# EAGLE design Laundry_Switch (EAGLE 8.7.0)
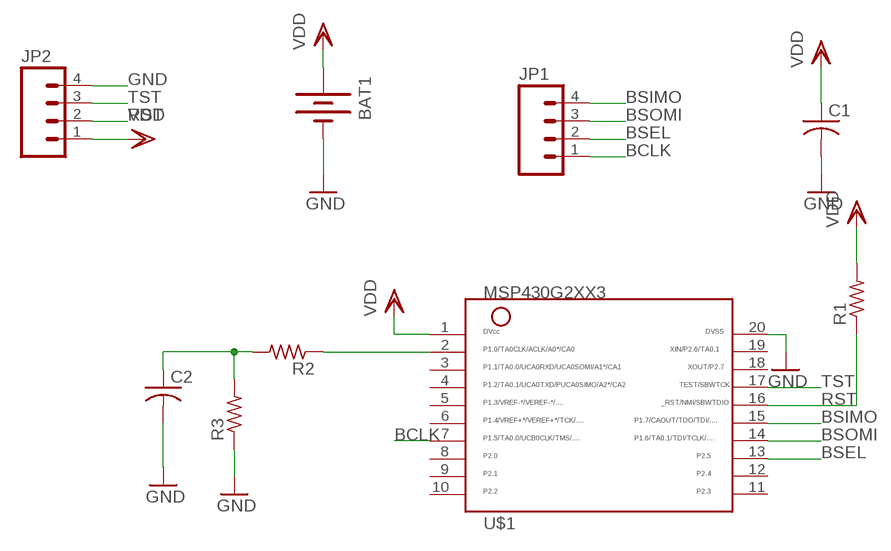
[diagram p0: schematic, sheet 1]

## Parts
BAT1  BATTERYBU2032SM  [BU2032SM]
C1  RCL_C-USC1206  [RCL_C1206]
C2  C-US050-050X075  [C050-050X075]
JP1  PENDANT_M04LOCK  [PENDANT_1X04_LOCK]
JP2  PENDANT_M04LOCK  [PENDANT_1X04_LOCK]
R1  RCL_R-US_R1206  [RCL_R1206]
R2  RCL_R-US_R1206  [RCL_R1206]
R3  RCL_R-US_R1206  [RCL_R1206]
U$1  MSP430G2XX3TSSOP  [PW20]

## Nets
BCLK: JP1.1 U$1.7
BSEL: JP1.2 U$1.13
BSIMO: JP1.4 U$1.15
BSOMI: JP1.3 U$1.14
GND: BAT1.P$2(-) C1.2 C2.2 JP2.4 R3.1 U$1.20
N$1: R2.1 U$1.2
N$3: C2.1 R2.2 R3.2
RST: JP2.2 R1.1 U$1.16
TST: JP2.3 U$1.17
VDD: BAT1.P$1(+) C1.1 JP2.1 R1.2 U$1.1
Unconnected: U$1.3 U$1.4 U$1.5 U$1.6 U$1.8 U$1.9 U$1.10 U$1.11 U$1.12 U$1.18 U$1.19

## Library data of the parts
BAT1 = ELEC327:BATTERY: Battery Holders Various common sizes : AA, AAA, 20mm coin cell and 12mm coin cell. 20MM_4LEGS, BATT-10373
C1 = Pendant:RCL_C-US: CAPACITOR, American symbol
C2 = rcl:C-US: CAPACITOR, American symbol; SPICEPREFIX: C
JP1 JP2 = Bonus:PENDANT_M04: Header 4 Standard 4-pin 0.1" header. Use with straight break away headers (SKU : PRT-00116), right angle break away headers (PRT-00553), swiss pins (PRT-00743), machine pins (PRT-00117), and female headers (PRT-00115). Molex polarized connector foot print use with SKU : PRT-08231 with associated crimp pins and housings.
R1-R3 = Pendant:RCL_R-US_: RESISTOR, American symbol
U$1 = ELEC327:MSP430G2XX3: MSP430G2XX3 PDIP (N) 20 Pin Package

## Board
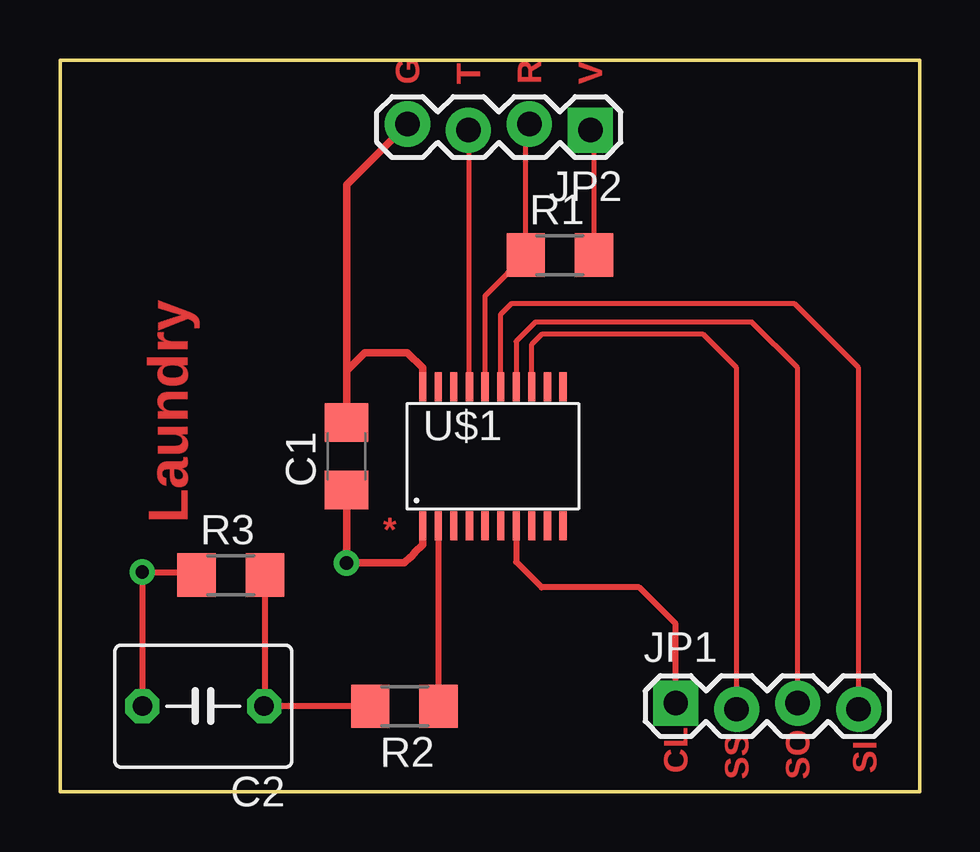
[diagram p1: board, top side]
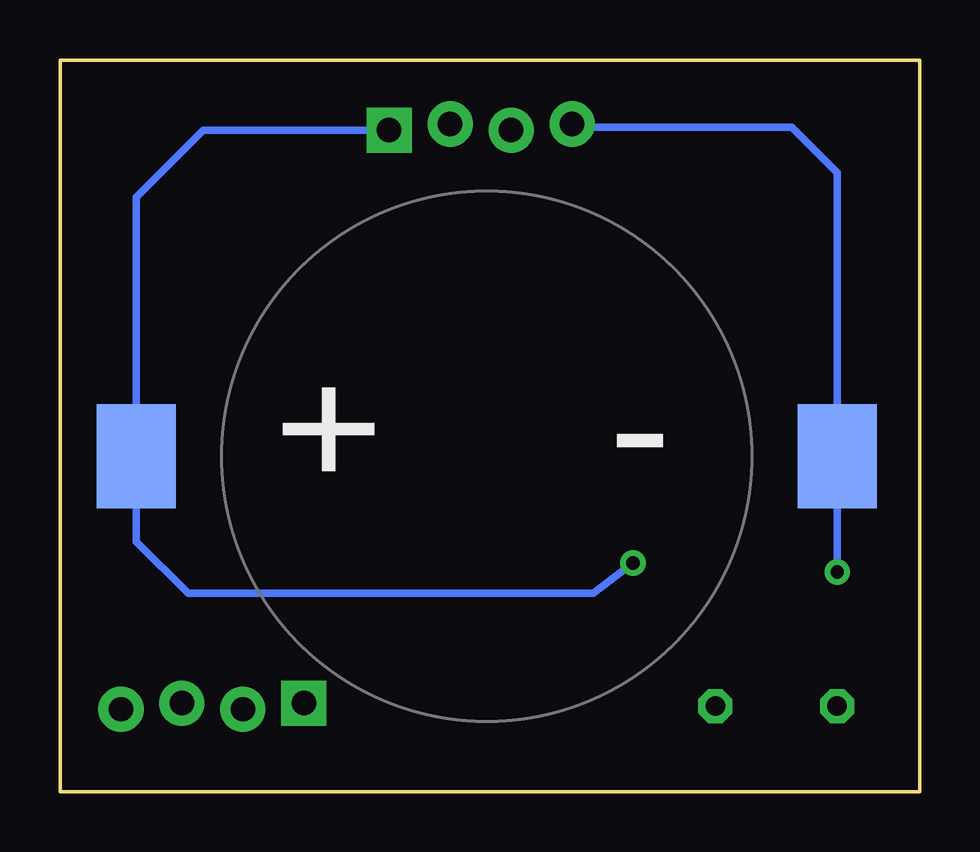
[diagram p2: board, bottom side, seen from below]

Size 35.81 x 30.48 mm. Coordinates in mm from the lower left corner, seen from the top.
Outline: 0,0 0,30.48 35.81,30.48 35.81,0 0,0
Copper layers (1*16): Top 0.035mm / dielectric 1.5mm / Bottom 0.035mm
Design rules "AdvancedCircuitsBarebones": minimum track width 6mil, minimum drill 20mil, track to track 6mil, track to pad 6mil, pad to pad 6mil, via to via 6mil, smd to smd 6mil, copper to edge 10mil, drill to drill 6mil, minimum pad ring 12mil, minimum via ring 10mil, stop-mask expansion 4mil, vias tented up to drill 25mil, thermal gap 10mil

### Footprints (pad centres in the part's own frame; a part is rotated, then mirrored left to right if it is on the bottom)
BU2032SM = smd 3.302 x 4.318: P$1 -14.605,0; P$2 14.605,0
RCL_C1206 = smd 1.6 x 1.8: 1 -1.4,0; 2 1.4,0
C050-050X075 = drill 0.813 octagon: 1 -2.54,0; 2 2.54,0
PENDANT_1X04_LOCK = drill 1.016 pad 1.88 square: 1 0,0.127 | drill 1.016 pad 1.88: 2 2.54,-0.127; 3 5.08,0.127; 4 7.62,-0.127
RCL_R1206 = smd 1.6 x 1.803: 1 -1.422,0; 2 1.422,0
PW20 = smd 0.3 x 1.2: 1 -2.925,-2.9; 2 -2.275,-2.9; 3 -1.625,-2.9; 4 -0.975,-2.9; 5 -0.325,-2.9; 6 0.325,-2.9; 7 0.975,-2.9; 8 1.625,-2.9; 9 2.275,-2.9; 10 2.925,-2.9; 11 2.925,2.9; 12 2.275,2.9; 13 1.625,2.9; 14 0.975,2.9; 15 0.325,2.9; 16 -0.325,2.9; 17 -0.975,2.9; 18 -1.625,2.9; 19 -2.275,2.9; 20 -2.925,2.9

### Placement (x,y rotation side)
BAT1  18.03,13.97 0 bottom
C1  11.94,13.97 90 top
C2  5.97,3.56 180 top
JP1  25.65,3.56 0 top
JP2  22.1,27.69 180 top
R1  20.83,22.35 0 top
R2  14.35,3.56 180 top
R3  7.11,9.02 0 top
U$1  18.03,13.97 0 top

### Tracks (layer width: path | path; a pad name or v marks a point on that pad's centre or on a via)
BCLK
  Top 0.254: U$1.7 19.01,9.57 20.07,8.51 24.13,8.51 25.65,6.99 JP1.1
BSEL
  Top 0.203: U$1.13 19.66,18.64 20.07,19.05 26.8,19.05 28.19,17.65 JP1.2
BSIMO
  Top 0.203: U$1.15 18.36,19.88 18.8,20.32 30.61,20.32 33.27,17.65 JP1.4
BSOMI
  Top 0.203: U$1.14 19.01,18.75 19.81,19.56 28.83,19.56 30.73,17.65 JP1.3
GND  (via drill 0.55)
  Top 0.254: C2.2 v3.43,9.14 5.56,9.14 R3.1
  Top 0.305: C1.2 11.94,17.53 | 11.94,17.53 12.7,18.29 14.48,18.29 15.11,17.66 U$1.20 | 11.94,17.53 11.94,25.27 JP2.4 | v3.43,9.14
  Bottom 0.305: JP2.4 14.35,27.69 5.33,27.69 3.43,25.78 BAT1.P$2 v3.43,9.14
N$1
  Top 0.254: U$1.2 15.76,3.57 R2.1
N$3
  Top 0.254: R2.2 C2.1 8.53,3.58 R3.2
RST
  Top 0.203: U$1.16 17.71,20.66 19.56,22.5 | R1.1 19.41,27.66 JP2.2
  Top 0.305: 19.56,22.5 R1.1
TST
  Top 0.203: U$1.17 17.06,27.52 JP2.3
VDD  (via drill 0.55)
  Top 0.203: R1.2 22.25,27.41 JP2.1
  Top 0.305: C1.1 v11.94,9.53 14.35,9.53 14.6,9.77 14.61,9.77 14.79,9.95 14.79,9.96 15.11,10.29 U$1.1
  Bottom 0.305: JP2.1 29.84,27.56 32.64,24.77 BAT1.P$1 32.64,10.41 30.48,8.26 13.59,8.26 v11.94,9.53

### Text on the board
Top: G | T | R | V | Laundry | * | CL | SS | SO | SI